# EAGLE schematic WestLaunch (EAGLE 7.7.0)
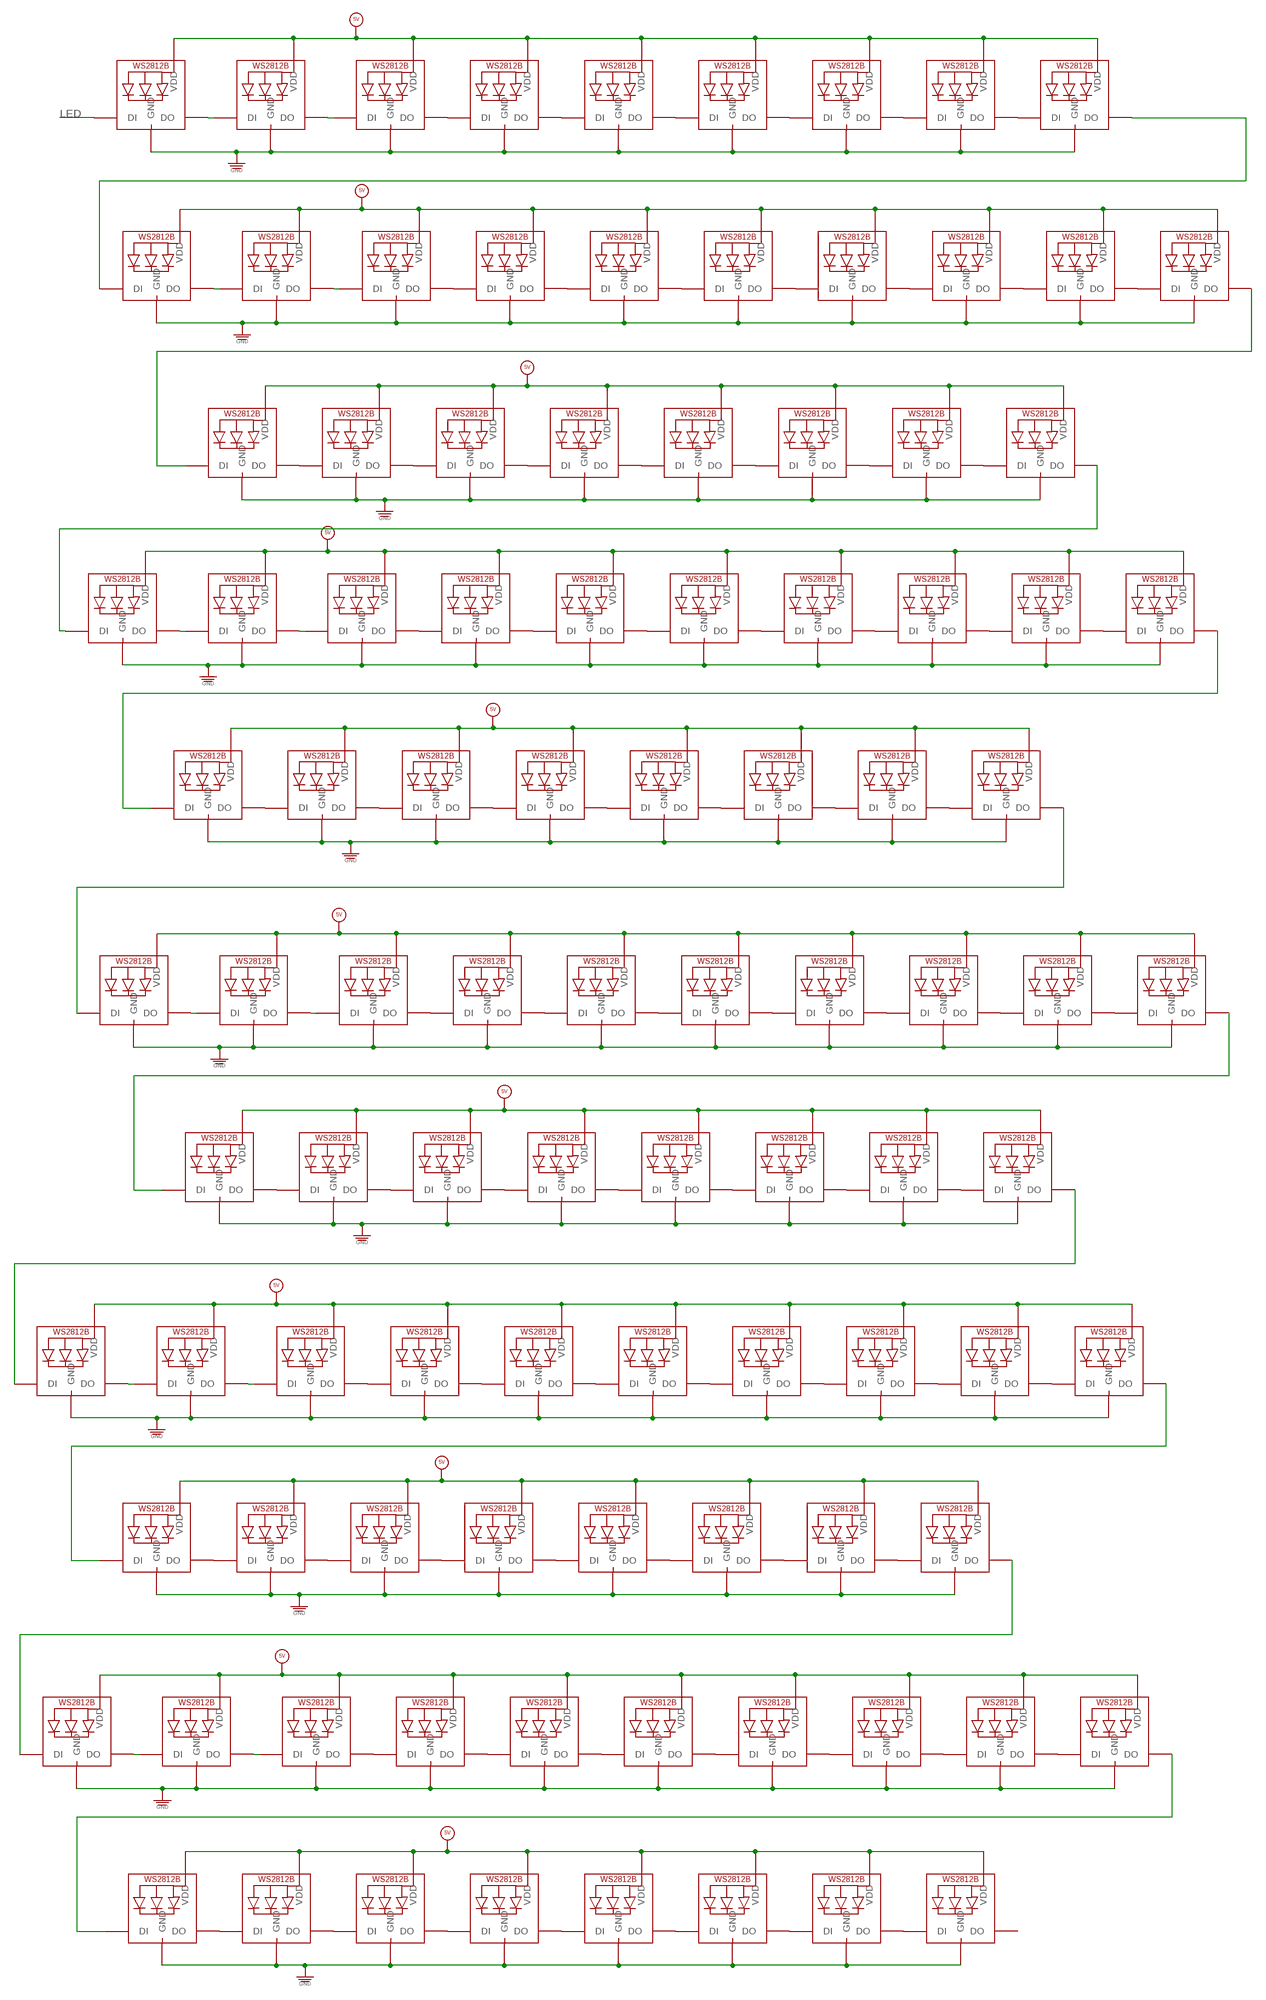
[diagram p0: schematic, sheet 1, part 1 of 2]
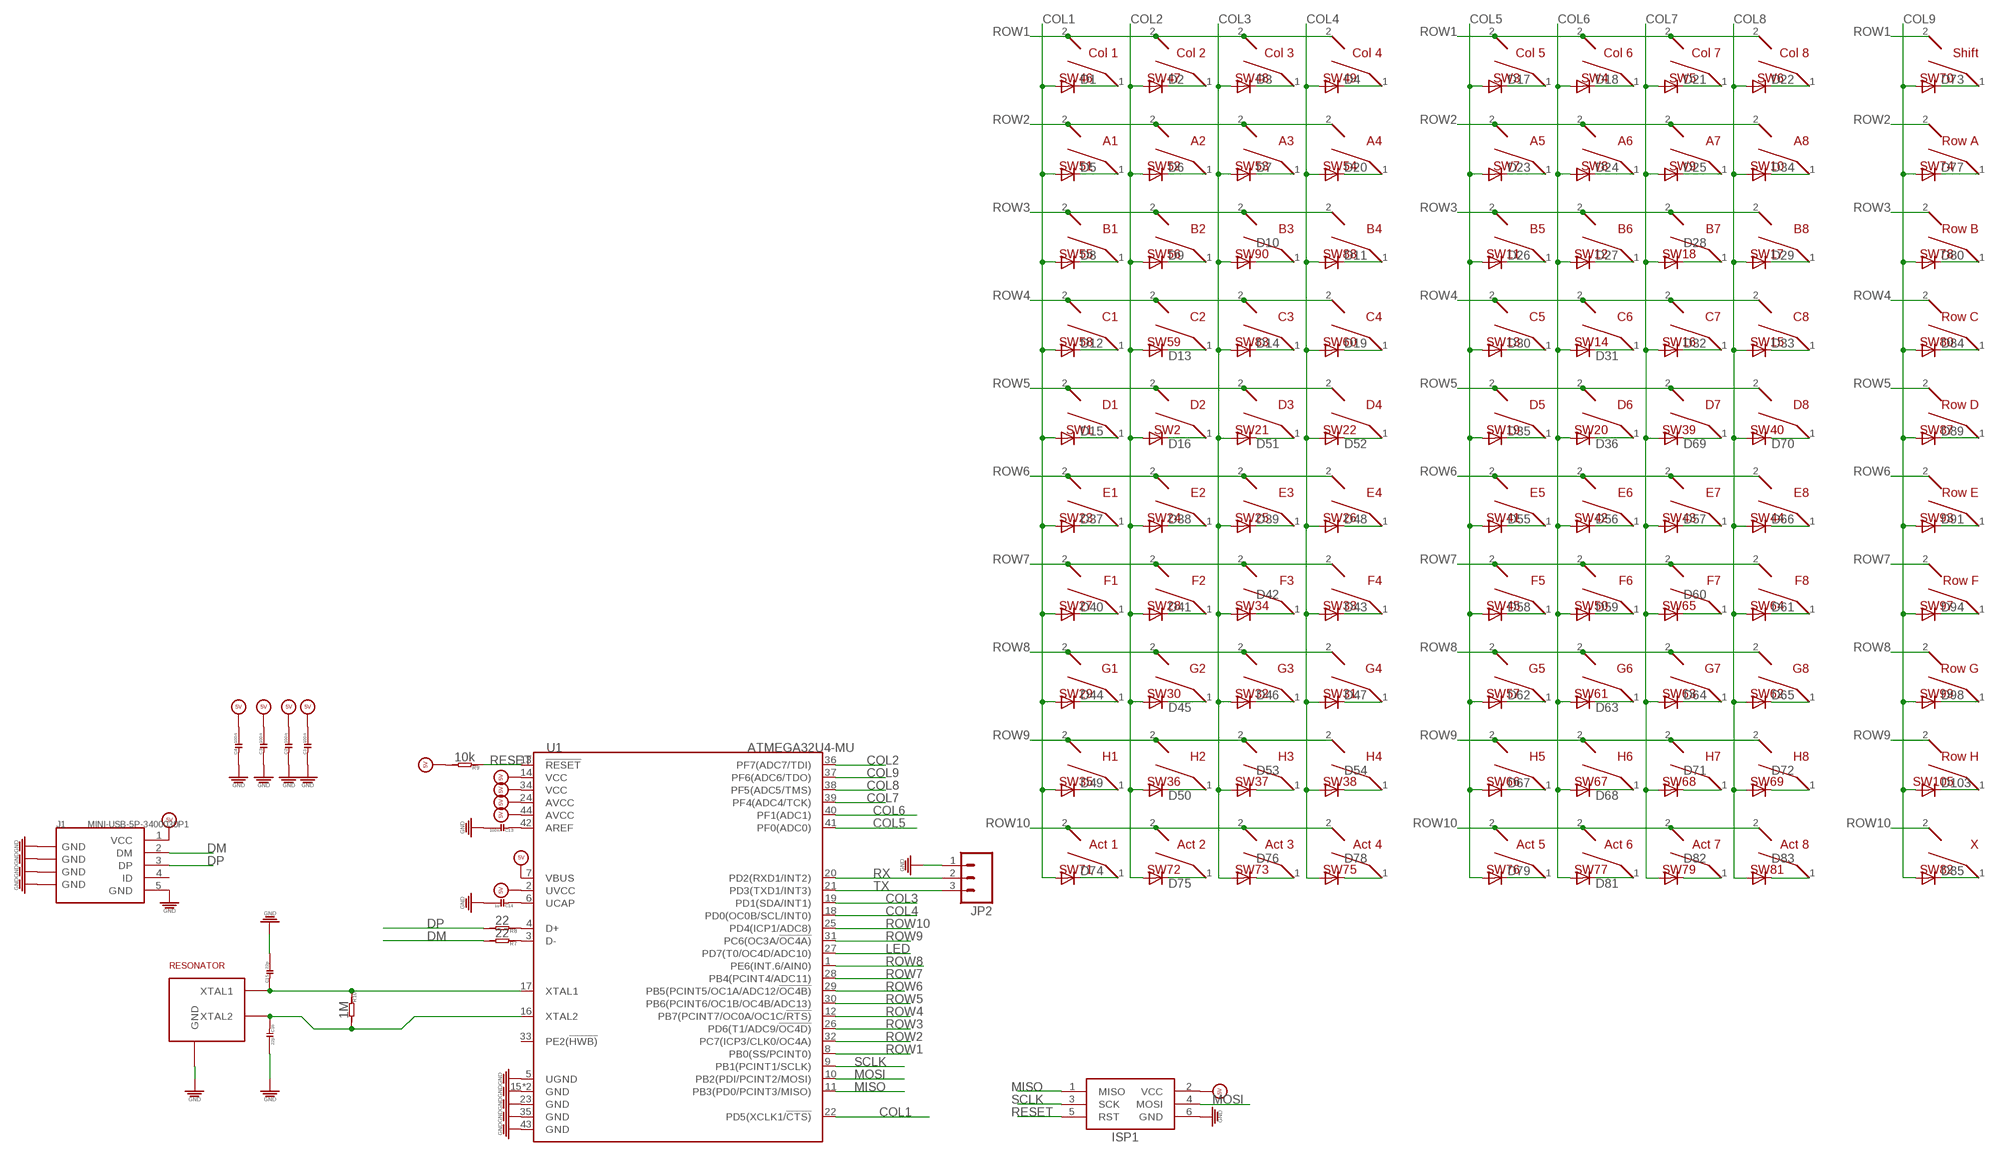
[diagram p1: schematic, sheet 1, part 2 of 2]

## Parts
C1  100n  C-0603  [C0603]
C2  100n  C-0603  [C0603]
C3  100n  C-0603  [C0603]
C4  100n  C-0603  [C0603]
C13  100n  C-0603  [C0603]
C14  1u  C-0603  [C0603]
C15  22p  C-0603  [C0603]
C16  22p  C-0603  [C0603]
D1  CGRM4001-G  [SOD-123_MINI-SMA]
D2  CGRM4001-G  [SOD-123_MINI-SMA]
D3  CGRM4001-G  [SOD-123_MINI-SMA]
D4  CGRM4001-G  [SOD-123_MINI-SMA]
D5  CGRM4001-G  [SOD-123_MINI-SMA]
D6  CGRM4001-G  [SOD-123_MINI-SMA]
D7  CGRM4001-G  [SOD-123_MINI-SMA]
D8  CGRM4001-G  [SOD-123_MINI-SMA]
D9  CGRM4001-G  [SOD-123_MINI-SMA]
D10  CGRM4001-G  [SOD-123_MINI-SMA]
D11  CGRM4001-G  [SOD-123_MINI-SMA]
D12  CGRM4001-G  [SOD-123_MINI-SMA]
D13  CGRM4001-G  [SOD-123_MINI-SMA]
D14  CGRM4001-G  [SOD-123_MINI-SMA]
D15  CGRM4001-G  [SOD-123_MINI-SMA]
D16  CGRM4001-G  [SOD-123_MINI-SMA]
D17  CGRM4001-G  [SOD-123_MINI-SMA]
D18  CGRM4001-G  [SOD-123_MINI-SMA]
D19  CGRM4001-G  [SOD-123_MINI-SMA]
D20  CGRM4001-G  [SOD-123_MINI-SMA]
D21  CGRM4001-G  [SOD-123_MINI-SMA]
D22  CGRM4001-G  [SOD-123_MINI-SMA]
D23  CGRM4001-G  [SOD-123_MINI-SMA]
D24  CGRM4001-G  [SOD-123_MINI-SMA]
D25  CGRM4001-G  [SOD-123_MINI-SMA]
D26  CGRM4001-G  [SOD-123_MINI-SMA]
D27  CGRM4001-G  [SOD-123_MINI-SMA]
D28  CGRM4001-G  [SOD-123_MINI-SMA]
D29  CGRM4001-G  [SOD-123_MINI-SMA]
D30  CGRM4001-G  [SOD-123_MINI-SMA]
D31  CGRM4001-G  [SOD-123_MINI-SMA]
D32  CGRM4001-G  [SOD-123_MINI-SMA]
D33  CGRM4001-G  [SOD-123_MINI-SMA]
D34  CGRM4001-G  [SOD-123_MINI-SMA]
D35  CGRM4001-G  [SOD-123_MINI-SMA]
D36  CGRM4001-G  [SOD-123_MINI-SMA]
D37  CGRM4001-G  [SOD-123_MINI-SMA]
D38  CGRM4001-G  [SOD-123_MINI-SMA]
D39  CGRM4001-G  [SOD-123_MINI-SMA]
D40  CGRM4001-G  [SOD-123_MINI-SMA]
D41  CGRM4001-G  [SOD-123_MINI-SMA]
D42  CGRM4001-G  [SOD-123_MINI-SMA]
D43  CGRM4001-G  [SOD-123_MINI-SMA]
D44  CGRM4001-G  [SOD-123_MINI-SMA]
D45  CGRM4001-G  [SOD-123_MINI-SMA]
D46  CGRM4001-G  [SOD-123_MINI-SMA]
D47  CGRM4001-G  [SOD-123_MINI-SMA]
D48  CGRM4001-G  [SOD-123_MINI-SMA]
D49  CGRM4001-G  [SOD-123_MINI-SMA]
D50  CGRM4001-G  [SOD-123_MINI-SMA]
D51  CGRM4001-G  [SOD-123_MINI-SMA]
D52  CGRM4001-G  [SOD-123_MINI-SMA]
D53  CGRM4001-G  [SOD-123_MINI-SMA]
D54  CGRM4001-G  [SOD-123_MINI-SMA]
D55  CGRM4001-G  [SOD-123_MINI-SMA]
D56  CGRM4001-G  [SOD-123_MINI-SMA]
D57  CGRM4001-G  [SOD-123_MINI-SMA]
D58  CGRM4001-G  [SOD-123_MINI-SMA]
D59  CGRM4001-G  [SOD-123_MINI-SMA]
D60  CGRM4001-G  [SOD-123_MINI-SMA]
D61  CGRM4001-G  [SOD-123_MINI-SMA]
D62  CGRM4001-G  [SOD-123_MINI-SMA]
D63  CGRM4001-G  [SOD-123_MINI-SMA]
D64  CGRM4001-G  [SOD-123_MINI-SMA]
D65  CGRM4001-G  [SOD-123_MINI-SMA]
D66  CGRM4001-G  [SOD-123_MINI-SMA]
D67  CGRM4001-G  [SOD-123_MINI-SMA]
D68  CGRM4001-G  [SOD-123_MINI-SMA]
D69  CGRM4001-G  [SOD-123_MINI-SMA]
D70  CGRM4001-G  [SOD-123_MINI-SMA]
D71  CGRM4001-G  [SOD-123_MINI-SMA]
D72  CGRM4001-G  [SOD-123_MINI-SMA]
D73  CGRM4001-G  [SOD-123_MINI-SMA]
D74  CGRM4001-G  [SOD-123_MINI-SMA]
D75  CGRM4001-G  [SOD-123_MINI-SMA]
D76  CGRM4001-G  [SOD-123_MINI-SMA]
D77  CGRM4001-G  [SOD-123_MINI-SMA]
D78  CGRM4001-G  [SOD-123_MINI-SMA]
D79  CGRM4001-G  [SOD-123_MINI-SMA]
D80  CGRM4001-G  [SOD-123_MINI-SMA]
D81  CGRM4001-G  [SOD-123_MINI-SMA]
D82  CGRM4001-G  [SOD-123_MINI-SMA]
D83  CGRM4001-G  [SOD-123_MINI-SMA]
D84  CGRM4001-G  [SOD-123_MINI-SMA]
D85  CGRM4001-G  [SOD-123_MINI-SMA]
D89  CGRM4001-G  [SOD-123_MINI-SMA]
D91  CGRM4001-G  [SOD-123_MINI-SMA]
D94  CGRM4001-G  [SOD-123_MINI-SMA]
D98  CGRM4001-G  [SOD-123_MINI-SMA]
D103  CGRM4001-G  [SOD-123_MINI-SMA]
ISP1  AVRISP-6  [AVRISP]
J1  MINI-USB-5P-3400030P1  [MINI-B-5P-SMD]
JP2  M03PTH  [1X03]
LED1  WS2812B3535  [LED3535]
LED2  WS2812B3535  [LED3535]
LED3  WS2812B3535  [LED3535]
LED4  WS2812B3535  [LED3535]
LED5  WS2812B3535  [LED3535]
LED6  WS2812B3535  [LED3535]
LED7  WS2812B3535  [LED3535]
LED8  WS2812B3535  [LED3535]
LED9  WS2812B3535  [LED3535]
LED10  WS2812B3535  [LED3535]
LED11  WS2812B3535  [LED3535]
LED12  WS2812B3535  [LED3535]
LED13  WS2812B3535  [LED3535]
LED14  WS2812B3535  [LED3535]
LED15  WS2812B3535  [LED3535]
LED16  WS2812B3535  [LED3535]
LED17  WS2812B3535  [LED3535]
LED18  WS2812B3535  [LED3535]
LED19  WS2812B3535  [LED3535]
LED20  WS2812B3535  [LED3535]
LED21  WS2812B3535  [LED3535]
LED22  WS2812B3535  [LED3535]
LED23  WS2812B3535  [LED3535]
LED24  WS2812B3535  [LED3535]
LED25  WS2812B3535  [LED3535]
LED26  WS2812B3535  [LED3535]
LED27  WS2812B3535  [LED3535]
LED28  WS2812B3535  [LED3535]
LED29  WS2812B3535  [LED3535]
LED30  WS2812B3535  [LED3535]
LED31  WS2812B3535  [LED3535]
LED32  WS2812B3535  [LED3535]
LED33  WS2812B3535  [LED3535]
LED34  WS2812B3535  [LED3535]
LED35  WS2812B3535  [LED3535]
LED36  WS2812B3535  [LED3535]
LED37  WS2812B3535  [LED3535]
LED38  WS2812B3535  [LED3535]
LED39  WS2812B3535  [LED3535]
LED40  WS2812B3535  [LED3535]
LED41  WS2812B3535  [LED3535]
LED42  WS2812B3535  [LED3535]
LED43  WS2812B3535  [LED3535]
LED44  WS2812B3535  [LED3535]
LED45  WS2812B3535  [LED3535]
LED46  WS2812B3535  [LED3535]
LED47  WS2812B3535  [LED3535]
LED48  WS2812B3535  [LED3535]
LED49  WS2812B3535  [LED3535]
LED50  WS2812B3535  [LED3535]
LED51  WS2812B3535  [LED3535]
LED52  WS2812B3535  [LED3535]
LED53  WS2812B3535  [LED3535]
LED54  WS2812B3535  [LED3535]
LED55  WS2812B3535  [LED3535]
LED56  WS2812B3535  [LED3535]
LED57  WS2812B3535  [LED3535]
LED58  WS2812B3535  [LED3535]
LED59  WS2812B3535  [LED3535]
LED60  WS2812B3535  [LED3535]
LED61  WS2812B3535  [LED3535]
LED62  WS2812B3535  [LED3535]
LED63  WS2812B3535  [LED3535]
LED64  WS2812B3535  [LED3535]
LED65  WS2812B3535  [LED3535]
LED66  WS2812B3535  [LED3535]
LED67  WS2812B3535  [LED3535]
LED68  WS2812B3535  [LED3535]
LED69  WS2812B3535  [LED3535]
LED70  WS2812B3535  [LED3535]
LED71  WS2812B3535  [LED3535]
LED72  WS2812B3535  [LED3535]
LED73  WS2812B3535  [LED3535]
LED74  WS2812B3535  [LED3535]
LED75  WS2812B3535  [LED3535]
LED76  WS2812B3535  [LED3535]
LED77  WS2812B3535  [LED3535]
LED78  WS2812B3535  [LED3535]
LED79  WS2812B3535  [LED3535]
LED80  WS2812B3535  [LED3535]
LED81  WS2812B3535  [LED3535]
LED82  WS2812B3535  [LED3535]
LED83  WS2812B3535  [LED3535]
LED84  WS2812B3535  [LED3535]
LED85  WS2812B3535  [LED3535]
LED86  WS2812B3535  [LED3535]
LED87  WS2812B3535  [LED3535]
LED88  WS2812B3535  [LED3535]
LED89  WS2812B3535  [LED3535]
LED90  WS2812B3535  [LED3535]
LED91  WS2812B3535  [LED3535]
LED92  WS2812B3535  [LED3535]
LED93  WS2812B3535  [LED3535]
LED94  WS2812B3535  [LED3535]
LED95  WS2812B3535  [LED3535]
LED96  WS2812B3535  [LED3535]
LED97  WS2812B3535  [LED3535]
LED98  WS2812B3535  [LED3535]
LED99  WS2812B3535  [LED3535]
R7  22  R-0603  [R0603]
R8  22  R-0603  [R0603]
R9  10k  R-0603  [R0603]
R10  1M  R-0603  [R0603]
SW1  D1  CHERRY_MX_WITH_FIXING_PINS  [MX1A-XXNW]
SW2  D2  CHERRY_MX_WITH_FIXING_PINS  [MX1A-XXNW]
SW3  Col 5  CHERRY_MX_WITH_FIXING_PINS  [MX1A-XXNW]
SW4  Col 6  CHERRY_MX_WITH_FIXING_PINS  [MX1A-XXNW]
SW5  Col 7  CHERRY_MX_WITH_FIXING_PINS  [MX1A-XXNW]
SW6  Col 8  CHERRY_MX_WITH_FIXING_PINS  [MX1A-XXNW]
SW7  A5  CHERRY_MX_WITH_FIXING_PINS  [MX1A-XXNW]
SW8  A6  CHERRY_MX_WITH_FIXING_PINS  [MX1A-XXNW]
SW9  A7  CHERRY_MX_WITH_FIXING_PINS  [MX1A-XXNW]
SW10  A8  CHERRY_MX_WITH_FIXING_PINS  [MX1A-XXNW]
SW11  B5  CHERRY_MX_WITH_FIXING_PINS  [MX1A-XXNW]
SW12  B6  CHERRY_MX_WITH_FIXING_PINS  [MX1A-XXNW]
SW13  C5  CHERRY_MX_WITH_FIXING_PINS  [MX1A-XXNW]
SW14  C6  CHERRY_MX_WITH_FIXING_PINS  [MX1A-XXNW]
SW15  C8  CHERRY_MX_WITH_FIXING_PINS  [MX1A-XXNW]
SW16  C7  CHERRY_MX_WITH_FIXING_PINS  [MX1A-XXNW]
SW17  B8  CHERRY_MX_WITH_FIXING_PINS  [MX1A-XXNW]
SW18  B7  CHERRY_MX_WITH_FIXING_PINS  [MX1A-XXNW]
SW19  D5  CHERRY_MX_WITH_FIXING_PINS  [MX1A-XXNW]
SW20  D6  CHERRY_MX_WITH_FIXING_PINS  [MX1A-XXNW]
SW21  D3  CHERRY_MX_WITH_FIXING_PINS  [MX1A-XXNW]
SW22  D4  CHERRY_MX_WITH_FIXING_PINS  [MX1A-XXNW]
SW23  E1  CHERRY_MX_WITH_FIXING_PINS  [MX1A-XXNW]
SW24  E2  CHERRY_MX_WITH_FIXING_PINS  [MX1A-XXNW]
SW25  E3  CHERRY_MX_WITH_FIXING_PINS  [MX1A-XXNW]
SW26  E4  CHERRY_MX_WITH_FIXING_PINS  [MX1A-XXNW]
SW27  F1  CHERRY_MX_WITH_FIXING_PINS  [MX1A-XXNW]
SW28  F2  CHERRY_MX_WITH_FIXING_PINS  [MX1A-XXNW]
SW29  G1  CHERRY_MX_WITH_FIXING_PINS  [MX1A-XXNW]
SW30  G2  CHERRY_MX_WITH_FIXING_PINS  [MX1A-XXNW]
SW31  G4  CHERRY_MX_WITH_FIXING_PINS  [MX1A-XXNW]
SW32  G3  CHERRY_MX_WITH_FIXING_PINS  [MX1A-XXNW]
SW33  F4  CHERRY_MX_WITH_FIXING_PINS  [MX1A-XXNW]
SW34  F3  CHERRY_MX_WITH_FIXING_PINS  [MX1A-XXNW]
SW35  H1  CHERRY_MX_WITH_FIXING_PINS  [MX1A-XXNW]
SW36  H2  CHERRY_MX_WITH_FIXING_PINS  [MX1A-XXNW]
SW37  H3  CHERRY_MX_WITH_FIXING_PINS  [MX1A-XXNW]
SW38  H4  CHERRY_MX_WITH_FIXING_PINS  [MX1A-XXNW]
SW39  D7  CHERRY_MX_WITH_FIXING_PINS  [MX1A-XXNW]
SW40  D8  CHERRY_MX_WITH_FIXING_PINS  [MX1A-XXNW]
SW41  E5  CHERRY_MX_WITH_FIXING_PINS  [MX1A-XXNW]
SW42  E6  CHERRY_MX_WITH_FIXING_PINS  [MX1A-XXNW]
SW43  E7  CHERRY_MX_WITH_FIXING_PINS  [MX1A-XXNW]
SW44  E8  CHERRY_MX_WITH_FIXING_PINS  [MX1A-XXNW]
SW45  F5  CHERRY_MX_WITH_FIXING_PINS  [MX1A-XXNW]
SW46  Col 1  CHERRY_MX_WITH_FIXING_PINS  [MX1A-XXNW]
SW47  Col 2  CHERRY_MX_WITH_FIXING_PINS  [MX1A-XXNW]
SW48  Col 3  CHERRY_MX_WITH_FIXING_PINS  [MX1A-XXNW]
SW49  Col 4  CHERRY_MX_WITH_FIXING_PINS  [MX1A-XXNW]
SW50  F6  CHERRY_MX_WITH_FIXING_PINS  [MX1A-XXNW]
SW51  A1  CHERRY_MX_WITH_FIXING_PINS  [MX1A-XXNW]
SW52  A2  CHERRY_MX_WITH_FIXING_PINS  [MX1A-XXNW]
SW53  A3  CHERRY_MX_WITH_FIXING_PINS  [MX1A-XXNW]
SW54  A4  CHERRY_MX_WITH_FIXING_PINS  [MX1A-XXNW]
SW55  B1  CHERRY_MX_WITH_FIXING_PINS  [MX1A-XXNW]
SW56  B2  CHERRY_MX_WITH_FIXING_PINS  [MX1A-XXNW]
SW57  G5  CHERRY_MX_WITH_FIXING_PINS  [MX1A-XXNW]
SW58  C1  CHERRY_MX_WITH_FIXING_PINS  [MX1A-XXNW]
SW59  C2  CHERRY_MX_WITH_FIXING_PINS  [MX1A-XXNW]
SW60  C4  CHERRY_MX_WITH_FIXING_PINS  [MX1A-XXNW]
SW61  G6  CHERRY_MX_WITH_FIXING_PINS  [MX1A-XXNW]
SW62  G8  CHERRY_MX_WITH_FIXING_PINS  [MX1A-XXNW]
SW63  G7  CHERRY_MX_WITH_FIXING_PINS  [MX1A-XXNW]
SW64  F8  CHERRY_MX_WITH_FIXING_PINS  [MX1A-XXNW]
SW65  F7  CHERRY_MX_WITH_FIXING_PINS  [MX1A-XXNW]
SW66  H5  CHERRY_MX_WITH_FIXING_PINS  [MX1A-XXNW]
SW67  H6  CHERRY_MX_WITH_FIXING_PINS  [MX1A-XXNW]
SW68  H7  CHERRY_MX_WITH_FIXING_PINS  [MX1A-XXNW]
SW69  H8  CHERRY_MX_WITH_FIXING_PINS  [MX1A-XXNW]
SW70  Shift  CHERRY_MX_WITH_FIXING_PINS  [MX1A-XXNW]
SW71  Act 1  CHERRY_MX_WITH_FIXING_PINS  [MX1A-XXNW]
SW72  Act 2  CHERRY_MX_WITH_FIXING_PINS  [MX1A-XXNW]
SW73  Act 3  CHERRY_MX_WITH_FIXING_PINS  [MX1A-XXNW]
SW74  Row A  CHERRY_MX_WITH_FIXING_PINS  [MX1A-XXNW]
SW75  Act 4  CHERRY_MX_WITH_FIXING_PINS  [MX1A-XXNW]
SW76  Act 5  CHERRY_MX_WITH_FIXING_PINS  [MX1A-XXNW]
SW77  Act 6  CHERRY_MX_WITH_FIXING_PINS  [MX1A-XXNW]
SW78  Row B  CHERRY_MX_WITH_FIXING_PINS  [MX1A-XXNW]
SW79  Act 7  CHERRY_MX_WITH_FIXING_PINS  [MX1A-XXNW]
SW80  Row C  CHERRY_MX_WITH_FIXING_PINS  [MX1A-XXNW]
SW81  Act 8  CHERRY_MX_WITH_FIXING_PINS  [MX1A-XXNW]
SW82  X  CHERRY_MX_WITH_FIXING_PINS  [MX1A-XXNW]
SW83  C3  CHERRY_MX_WITH_FIXING_PINS  [MX1A-XXNW]
SW87  Row D  CHERRY_MX_WITH_FIXING_PINS  [MX1A-XXNW]
SW88  B4  CHERRY_MX_WITH_FIXING_PINS  [MX1A-XXNW]
SW90  B3  CHERRY_MX_WITH_FIXING_PINS  [MX1A-XXNW]
SW93  Row E  CHERRY_MX_WITH_FIXING_PINS  [MX1A-XXNW]
SW97  Row F  CHERRY_MX_WITH_FIXING_PINS  [MX1A-XXNW]
SW99  Row G  CHERRY_MX_WITH_FIXING_PINS  [MX1A-XXNW]
SW105  Row H  CHERRY_MX_WITH_FIXING_PINS  [MX1A-XXNW]
U1  ATMEGA32U4-MU  [QFN44]
U$60  RESONATOR  [16MHZXTAL]

## Nets
5V [power]: C1.2 C2.2 C3.2 C4.2 ISP1.2(VCC) J1.1(VCC) LED1.1(VDD) LED2.1(VDD) LED3.1(VDD) LED4.1(VDD) LED5.1(VDD) LED6.1(VDD) LED7.1(VDD) LED8.1(VDD) LED9.1(VDD) LED10.1(VDD) LED11.1(VDD) LED12.1(VDD) LED13.1(VDD) LED14.1(VDD) LED15.1(VDD) LED16.1(VDD) LED17.1(VDD) LED18.1(VDD) LED19.1(VDD) LED20.1(VDD) LED21.1(VDD) LED22.1(VDD) LED23.1(VDD) LED24.1(VDD) LED25.1(VDD) LED26.1(VDD) LED27.1(VDD) LED28.1(VDD) LED29.1(VDD) LED30.1(VDD) LED31.1(VDD) LED32.1(VDD) LED33.1(VDD) LED34.1(VDD) LED35.1(VDD) LED36.1(VDD) LED37.1(VDD) LED38.1(VDD) LED39.1(VDD) LED40.1(VDD) LED41.1(VDD) LED42.1(VDD) LED43.1(VDD) LED44.1(VDD) LED45.1(VDD) LED46.1(VDD) LED47.1(VDD) LED48.1(VDD) LED49.1(VDD) LED50.1(VDD) LED51.1(VDD) LED52.1(VDD) LED53.1(VDD) LED54.1(VDD) LED55.1(VDD) LED56.1(VDD) LED57.1(VDD) LED58.1(VDD) LED59.1(VDD) LED60.1(VDD) LED61.1(VDD) LED62.1(VDD) LED63.1(VDD) LED64.1(VDD) LED65.1(VDD) LED66.1(VDD) LED67.1(VDD) LED68.1(VDD) LED69.1(VDD) LED70.1(VDD) LED71.1(VDD) LED72.1(VDD) LED73.1(VDD) LED74.1(VDD) LED75.1(VDD) LED76.1(VDD) LED77.1(VDD) LED78.1(VDD) LED79.1(VDD) LED80.1(VDD) LED81.1(VDD) LED82.1(VDD) LED83.1(VDD) LED84.1(VDD) LED85.1(VDD) LED86.1(VDD) LED87.1(VDD) LED88.1(VDD) LED89.1(VDD) LED90.1(VDD) LED91.1(VDD) LED92.1(VDD) LED93.1(VDD) LED94.1(VDD) LED95.1(VDD) LED96.1(VDD) LED97.1(VDD) LED98.1(VDD) LED99.1(VDD) R9.2 U1.2(UVCC) U1.7(VBUS) U1.14(VCC) U1.24(AVCC) U1.34(VCC) U1.44(AVCC)
COL1: D1.A D5.A D8.A D12.A D15.A D37.A D40.A D44.A D49.A D74.A U1.22(PD5(XCLK1/!CTS))
COL2: D2.A D6.A D9.A D13.A D16.A D38.A D41.A D45.A D50.A D75.A U1.36(PF7(ADC7/TDI))
COL3: D3.A D7.A D10.A D14.A D39.A D42.A D46.A D51.A D53.A D76.A U1.19(PD1(SDA/INT1))
COL4: D4.A D11.A D19.A D20.A D43.A D47.A D48.A D52.A D54.A D78.A U1.18(PD0(OC0B/SCL/INT0))
COL5: D17.A D23.A D26.A D30.A D35.A D55.A D58.A D62.A D67.A D79.A U1.41(PF0(ADC0))
COL6: D18.A D24.A D27.A D31.A D36.A D56.A D59.A D63.A D68.A D81.A U1.40(PF1(ADC1))
COL7: D21.A D25.A D28.A D32.A D57.A D60.A D64.A D69.A D71.A D82.A U1.39(PF4(ADC4/TCK))
COL8: D22.A D29.A D33.A D34.A D61.A D65.A D66.A D70.A D72.A D83.A U1.38(PF5(ADC5/TMS))
COL9: D73.A D77.A D80.A D84.A D85.A D89.A D91.A D94.A D98.A D103.A U1.37(PF6(ADC6/TDO))
DM: J1.2(DM) R7.2
DP: J1.3(DP) R8.2
GND: C1.1 C2.1 C3.1 C4.1 C13.2 C14.2 C15.2 C16.2 ISP1.6(GND) J1.5(GND) J1.GND@1(GND) J1.GND@2(GND) J1.GND@3(GND) J1.GND@4(GND) JP2.1 LED1.3(GND) LED2.3(GND) LED3.3(GND) LED4.3(GND) LED5.3(GND) LED6.3(GND) LED7.3(GND) LED8.3(GND) LED9.3(GND) LED10.3(GND) LED11.3(GND) LED12.3(GND) LED13.3(GND) LED14.3(GND) LED15.3(GND) LED16.3(GND) LED17.3(GND) LED18.3(GND) LED19.3(GND) LED20.3(GND) LED21.3(GND) LED22.3(GND) LED23.3(GND) LED24.3(GND) LED25.3(GND) LED26.3(GND) LED27.3(GND) LED28.3(GND) LED29.3(GND) LED30.3(GND) LED31.3(GND) LED32.3(GND) LED33.3(GND) LED34.3(GND) LED35.3(GND) LED36.3(GND) LED37.3(GND) LED38.3(GND) LED39.3(GND) LED40.3(GND) LED41.3(GND) LED42.3(GND) LED43.3(GND) LED44.3(GND) LED45.3(GND) LED46.3(GND) LED47.3(GND) LED48.3(GND) LED49.3(GND) LED50.3(GND) LED51.3(GND) LED52.3(GND) LED53.3(GND) LED54.3(GND) LED55.3(GND) LED56.3(GND) LED57.3(GND) LED58.3(GND) LED59.3(GND) LED60.3(GND) LED61.3(GND) LED62.3(GND) LED63.3(GND) LED64.3(GND) LED65.3(GND) LED66.3(GND) LED67.3(GND) LED68.3(GND) LED69.3(GND) LED70.3(GND) LED71.3(GND) LED72.3(GND) LED73.3(GND) LED74.3(GND) LED75.3(GND) LED76.3(GND) LED77.3(GND) LED78.3(GND) LED79.3(GND) LED80.3(GND) LED81.3(GND) LED82.3(GND) LED83.3(GND) LED84.3(GND) LED85.3(GND) LED86.3(GND) LED87.3(GND) LED88.3(GND) LED89.3(GND) LED90.3(GND) LED91.3(GND) LED92.3(GND) LED93.3(GND) LED94.3(GND) LED95.3(GND) LED96.3(GND) LED97.3(GND) LED98.3(GND) LED99.3(GND) U1.5(UGND) U1.15(GND) U1.23(GND) U1.35(GND) U1.43(GND) U1.TAB(GND) U$60.P$2(GND) U$60.P$4(GND)
LED: LED91.4(DI) U1.27(PD7(T0/OC4D/ADC10))
MISO: ISP1.1(MISO) U1.11(PB3(PD0/PCINT3/MISO))
MOSI: ISP1.4(MOSI) U1.10(PB2(PDI/PCINT2/MOSI))
N$1: D1.C SW46.1
N$2: D2.C SW47.1
N$3: D3.C SW48.1
N$4: D4.C SW49.1
N$5: D5.C SW51.1
N$6: D6.C SW52.1
N$7: D7.C SW53.1
N$8: D8.C SW55.1
N$9: D9.C SW56.1
N$10: D10.C SW90.1
N$11: D11.C SW88.1
N$12: D12.C SW58.1
N$13: D13.C SW59.1
N$14: D14.C SW83.1
N$15: D15.C SW1.1
N$16: D16.C SW2.1
N$17: LED1.2(DO) LED2.4(DI)
N$18: LED1.4(DI) LED28.2(DO)
N$19: D19.C SW60.1
N$20: D20.C SW54.1
N$21: D17.C SW3.1
N$22: D18.C SW4.1
N$23: D21.C SW5.1
N$24: D22.C SW6.1
N$25: D23.C SW7.1
N$26: D24.C SW8.1
N$27: D25.C SW9.1
N$28: D26.C SW11.1
N$29: D27.C SW12.1
N$30: D28.C SW18.1
N$31: D29.C SW17.1
N$32: D30.C SW13.1
N$33: D31.C SW14.1
N$34: D32.C SW16.1
N$35: D33.C SW15.1
N$36: D34.C SW10.1
N$37: D35.C SW19.1
N$38: D36.C SW20.1
N$39: D37.C SW23.1
N$40: D38.C SW24.1
N$41: D39.C SW25.1
N$42: D40.C SW27.1
N$43: D41.C SW28.1
N$44: D42.C SW34.1
N$45: D43.C SW33.1
N$46: D44.C SW29.1
N$47: D45.C SW30.1
N$48: LED13.2(DO) LED14.4(DI)
N$49: D46.C SW32.1
N$50: D47.C SW31.1
N$51: D48.C SW26.1
N$52: D49.C SW35.1
N$53: D50.C SW36.1
N$54: D51.C SW21.1
N$55: D52.C SW22.1
N$56: D53.C SW37.1
N$57: D54.C SW38.1
N$58: D55.C SW41.1
N$59: D56.C SW42.1
N$60: D57.C SW43.1
N$61: D58.C SW45.1
N$62: D59.C SW50.1
N$63: D60.C SW65.1
N$64: D61.C SW64.1
N$65: D62.C SW57.1
N$66: D63.C SW61.1
N$67: D64.C SW63.1
N$68: D65.C SW62.1
N$69: D66.C SW44.1
N$70: LED14.2(DO) LED15.4(DI)
N$71: LED15.2(DO) LED16.4(DI)
N$72: LED16.2(DO) LED17.4(DI)
N$73: LED18.2(DO) LED19.4(DI)
N$74: LED19.2(DO) LED20.4(DI)
N$75: LED20.2(DO) LED21.4(DI)
N$76: LED21.2(DO) LED22.4(DI)
N$77: LED17.2(DO) LED18.4(DI)
N$78: LED27.2(DO) LED28.4(DI)
N$79: D67.C SW66.1
N$80: LED23.2(DO) LED24.4(DI)
N$81: LED24.2(DO) LED25.4(DI)
N$82: LED25.2(DO) LED26.4(DI)
N$83: LED26.2(DO) LED27.4(DI)
N$84: D68.C SW67.1
N$85: D69.C SW39.1
N$86: D70.C SW40.1
N$87: D71.C SW68.1
N$88: D72.C SW69.1
N$89: D73.C SW70.1
N$90: LED22.2(DO) LED23.4(DI)
N$91: LED3.2(DO) LED4.4(DI)
N$92: LED4.2(DO) LED5.4(DI)
N$93: LED5.2(DO) LED6.4(DI)
N$94: D77.C SW74.1
N$95: LED6.2(DO) LED7.4(DI)
N$96: LED8.2(DO) LED9.4(DI)
N$97: D80.C SW78.1
N$98: LED9.2(DO) LED10.4(DI)
N$99: LED91.2(DO) LED92.4(DI)
N$100: LED92.2(DO) LED93.4(DI)
N$101: LED10.2(DO) LED11.4(DI)
N$102: LED11.2(DO) LED12.4(DI)
N$103: D84.C SW80.1
N$104: LED29.2(DO) LED30.4(DI)
N$105: LED30.2(DO) LED31.4(DI)
N$106: LED31.2(DO) LED32.4(DI)
N$107: LED32.2(DO) LED33.4(DI)
N$108: D89.C SW87.1
N$109: LED12.2(DO) LED29.4(DI)
N$110: C13.1 U1.42(AREF)
N$111: R8.1 U1.4(D+)
N$112: D91.C SW93.1
N$113: LED7.2(DO) LED8.4(DI)
N$114: LED33.2(DO) LED34.4(DI)
N$115: D94.C SW97.1
N$116: LED35.2(DO) LED36.4(DI)
N$117: R7.1 U1.3(D-)
N$118: C14.1 U1.6(UCAP)
N$119: C15.1 R10.1 U1.17(XTAL1) U$60.P$1(XTAL1)
N$120: C16.1 R10.2 U1.16(XTAL2) U$60.P$3(XTAL2)
N$121: LED34.2(DO) LED35.4(DI)
N$122: LED37.2(DO) LED38.4(DI)
N$123: D98.C SW99.1
N$124: LED38.2(DO) LED39.4(DI)
N$125: LED39.2(DO) LED40.4(DI)
N$126: LED40.2(DO) LED41.4(DI)
N$127: LED42.2(DO) LED43.4(DI)
N$128: D103.C SW105.1
N$129: LED43.2(DO) LED44.4(DI)
N$130: LED44.2(DO) LED45.4(DI)
N$131: LED45.2(DO) LED46.4(DI)
N$132: LED47.2(DO) LED48.4(DI)
N$133: LED48.2(DO) LED49.4(DI)
N$134: LED49.2(DO) LED50.4(DI)
N$135: LED50.2(DO) LED51.4(DI)
N$136: LED46.2(DO) LED47.4(DI)
N$137: LED41.2(DO) LED42.4(DI)
N$138: LED51.2(DO) LED52.4(DI)
N$139: LED53.2(DO) LED54.4(DI)
N$140: LED52.2(DO) LED53.4(DI)
N$141: LED55.2(DO) LED56.4(DI)
N$142: LED56.2(DO) LED57.4(DI)
N$143: LED57.2(DO) LED58.4(DI)
N$144: LED58.2(DO) LED59.4(DI)
N$145: LED60.2(DO) LED61.4(DI)
N$146: LED61.2(DO) LED62.4(DI)
N$147: LED62.2(DO) LED63.4(DI)
N$148: LED63.2(DO) LED64.4(DI)
N$149: LED65.2(DO) LED66.4(DI)
N$150: LED66.2(DO) LED67.4(DI)
N$151: LED67.2(DO) LED68.4(DI)
N$152: LED68.2(DO) LED69.4(DI)
N$153: LED64.2(DO) LED65.4(DI)
N$154: LED59.2(DO) LED60.4(DI)
N$155: LED69.2(DO) LED70.4(DI)
N$156: LED71.2(DO) LED72.4(DI)
N$157: LED70.2(DO) LED71.4(DI)
N$158: LED73.2(DO) LED74.4(DI)
N$159: LED74.2(DO) LED75.4(DI)
N$160: LED75.2(DO) LED76.4(DI)
N$161: LED76.2(DO) LED77.4(DI)
N$162: LED78.2(DO) LED79.4(DI)
N$163: LED79.2(DO) LED80.4(DI)
N$164: LED80.2(DO) LED81.4(DI)
N$165: LED81.2(DO) LED82.4(DI)
N$166: LED83.2(DO) LED84.4(DI)
N$167: LED84.2(DO) LED85.4(DI)
N$168: LED85.2(DO) LED86.4(DI)
N$169: LED86.2(DO) LED87.4(DI)
N$170: LED82.2(DO) LED83.4(DI)
N$171: LED77.2(DO) LED78.4(DI)
N$172: LED87.2(DO) LED88.4(DI)
N$173: LED89.2(DO) LED90.4(DI)
N$174: LED88.2(DO) LED89.4(DI)
N$175: LED2.2(DO) LED3.4(DI)
N$176: LED36.2(DO) LED37.4(DI)
N$177: LED54.2(DO) LED55.4(DI)
N$178: LED72.2(DO) LED73.4(DI)
N$179: D74.C SW71.1
N$180: D75.C SW72.1
N$181: D76.C SW73.1
N$182: D78.C SW75.1
N$183: D79.C SW76.1
N$184: D81.C SW77.1
N$185: D82.C SW79.1
N$186: D83.C SW81.1
N$187: D85.C SW82.1
N$188: LED93.2(DO) LED94.4(DI)
N$189: LED94.2(DO) LED95.4(DI)
N$190: LED96.2(DO) LED97.4(DI)
N$191: LED97.2(DO) LED98.4(DI)
N$192: LED98.2(DO) LED99.4(DI)
N$194: LED13.4(DI) LED99.2(DO)
N$195: LED95.2(DO) LED96.4(DI)
RESET: ISP1.5(RST) R9.1 U1.13(!RESET)
ROW1: SW3.2 SW4.2 SW5.2 SW6.2 SW46.2 SW47.2 SW48.2 SW49.2 SW70.2 U1.8(PB0(SS/PCINT0))
ROW2: SW7.2 SW8.2 SW9.2 SW10.2 SW51.2 SW52.2 SW53.2 SW54.2 SW74.2 U1.32(PC7(ICP3/CLK0/OC4A))
ROW3: SW11.2 SW12.2 SW17.2 SW18.2 SW55.2 SW56.2 SW78.2 SW88.2 SW90.2 U1.26(PD6(T1/ADC9/!OC4D))
ROW4: SW13.2 SW14.2 SW15.2 SW16.2 SW58.2 SW59.2 SW60.2 SW80.2 SW83.2 U1.12(PB7(PCINT7/OC0A/OC1C/!RTS))
ROW5: SW1.2 SW2.2 SW19.2 SW20.2 SW21.2 SW22.2 SW39.2 SW40.2 SW87.2 U1.30(PB6(PCINT6/OC1B/OC4B/ADC13))
ROW6: SW23.2 SW24.2 SW25.2 SW26.2 SW41.2 SW42.2 SW43.2 SW44.2 SW93.2 U1.29(PB5(PCINT5/OC1A/ADC12/!OC4B))
ROW7: SW27.2 SW28.2 SW33.2 SW34.2 SW45.2 SW50.2 SW64.2 SW65.2 SW97.2 U1.28(PB4(PCINT4/ADC11))
ROW8: SW29.2 SW30.2 SW31.2 SW32.2 SW57.2 SW61.2 SW62.2 SW63.2 SW99.2 U1.1(PE6(INT.6/AIN0))
ROW9: SW35.2 SW36.2 SW37.2 SW38.2 SW66.2 SW67.2 SW68.2 SW69.2 SW105.2 U1.31(PC6(OC3A/!OC4A))
ROW10: SW71.2 SW72.2 SW73.2 SW75.2 SW76.2 SW77.2 SW79.2 SW81.2 SW82.2 U1.25(PD4(ICP1/ADC8))
RX: JP2.2 U1.20(PD2(RXD1/INT2))
SCLK: ISP1.3(SCK) U1.9(PB1(PCINT1/SCLK))
TX: JP2.3 U1.21(PD3(TXD1/INT3))
Unconnected: J1.4(ID) LED90.2(DO) U1.33(PE2(!HWB))

## Library data of the parts
C1-C4 C13-C16 = OPL:C*
D1-D85 D89 D91 D94 D98 D103 = diode:CGRM400*-G: Molded plasitc,JEDEC SOD-123/Mini SMA Source: Comchip CGRM4001-G.pdf
ISP1 = adafruit:AVRISP: AVR ISP HEADER Standard 6 pin header for AVR programming
J1 = OPL:MINI-USB-5P: SMD Mini USB
JP2 = SparkFun-Connectors:M03: Header 3 Standard 3-pin 0.1" header. Use with straight break away headers (SKU : PRT-00116), right angle break away headers (PRT-00553), swiss pins (PRT-00743), machine pins (PRT-00117), and female headers (PRT-00115). Molex polarized connector foot print use with SKU : PRT-08232 with associated crimp pins and housings.; DESC: Serial
LED1-LED99 = EurorackModularParts:WS2812B
R7-R10 = OPL:R*
SW1-SW83 SW87 SW88 SW90 SW93 SW97 SW99 SW105 = Cherry_MX_v7.0:CHERRY_MX
U1 = IC:ATMEGA32U4: 8-bit Microcontroller With 16/32K Bytes of ISP Flash and USB controller
U$60 = EurorackModularParts:RESONATOR

## Net classes
0 default: width 0.254 mm
1 power: width 0.381 mm